# Altium schematic sheet 1.Input.SchDoc: 6.6kW Daul OBC +11kW WPT
size A3; Date: 23/03/6; Revision: V 1.0; SheetNumber: 1; SheetTotal: 14; PageSetup: Record=PageOptions|CenterHorizontal=True|CenterVertical=True|PrintScale=0.71|XCorrection=1.00|YCorrection=1.00|PrintKind=2|BorderSize=5000000|LeftOffset=0|BottomOffset=0|Orientation=2|PaperLength=1000|PaperWidth=1000|Scale=100|PaperSource=7|PrintQuality=-3|MediaType=1|DitherType=10|PrintScaleMode=1|PaperKind=A4|PaperIndex=9; ImagePath: 0
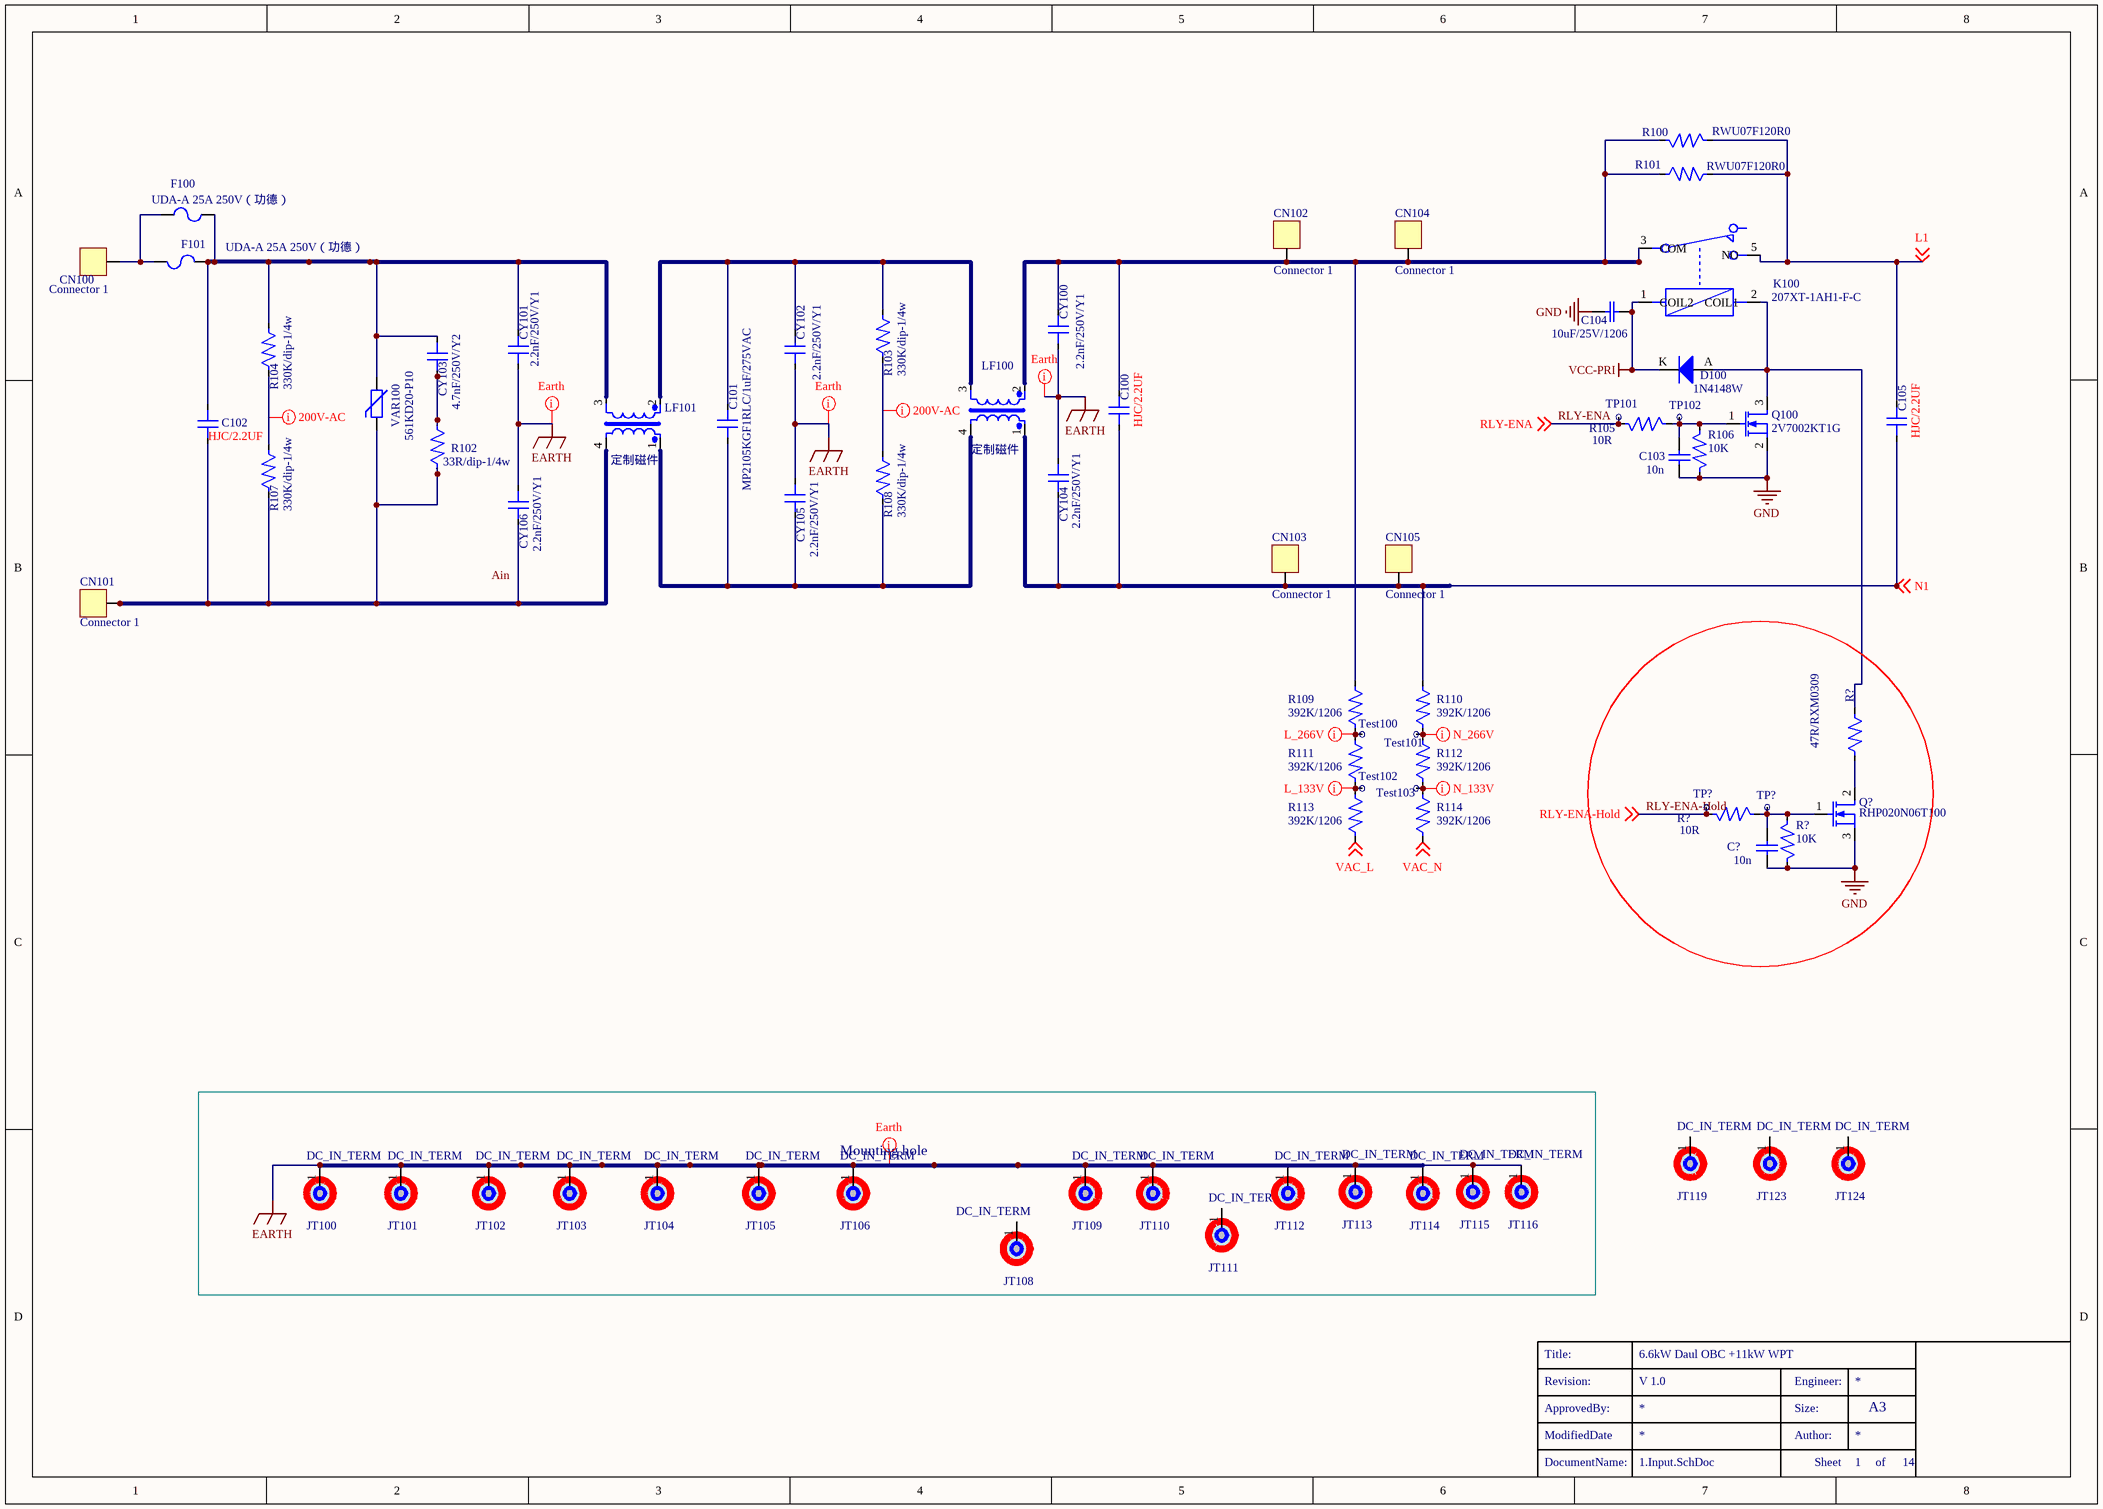
[diagram p0: 1.Input.SchDoc]

## Parts
(Parts that share a designator on the sheet are numbered #1, #2 ... from top to bottom, then left to right.)
C100  HJC/2.2UF  [CBOX_31x10_8_P_27_5]
C101  MP2105KGF1RLC/1uF/275VAC  [CBOX_31x10_8_P_27_5]
C102  HJC/2.2UF  [CBOX_31x13_P_27_5]
C103  10n  [C0402]
C104  10uF/25V/1206  [C1206]
C105  HJC/2.2UF  [CBOX_31x10_8_P_27_5]
C?  10n  [C0402]
CN100  Connector 1  [端子10x8x16]
CN101  Connector 1  [端子10x8x16]
CN102  Connector 1  [Wire_2.5_Hook]
CN103  Connector 1  [Wire_2.5_Hook]
CN104  Connector 1  [CON_4]
CN105  Connector 1  [CON_4]
CY100  2.2nF/250V/Y1  [C_DISK_7.5- D14]
CY101  2.2nF/250V/Y1  [C_DISK_7.5- D14]
CY102  2.2nF/250V/Y1  [C_DISK_7.5- D14]
CY103  4.7nF/250V/Y2  [C_DISK_8_0S]
CY104  2.2nF/250V/Y1  [C_DISK_7.5- D14]
CY105  2.2nF/250V/Y1  [C_DISK_7.5- D14]
CY106  2.2nF/250V/Y1  [C_DISK_7.5- D14]
D100  1N4148W  [D_SOD123]
F100  UDA-A 25A 250V（功德）  [Fuse-5.0-N_Vertical]
F101  UDA-A 25A 250V（功德）  [Fuse-5.0-N_Vertical]
JT100  DC_IN_TERM  [Mounting3_0]
JT101  DC_IN_TERM  [Mounting3_0]
JT102  DC_IN_TERM  [Mounting3_0]
JT103  DC_IN_TERM  [Mounting3_0]
JT104  DC_IN_TERM  [Mounting3_0]
JT105  DC_IN_TERM  [Mounting3_0]
JT106  DC_IN_TERM  [Mounting3_0]
JT108  DC_IN_TERM  [Mounting3_0]
JT109  DC_IN_TERM  [Mounting3_0]
JT110  DC_IN_TERM  [Mounting3_0]
JT111  DC_IN_TERM  [Mounting3_0]
JT112  DC_IN_TERM  [Mounting3_0]
JT113  DC_IN_TERM  [Mounting3_0]
JT114  DC_IN_TERM  [Mounting3_0]
JT115  DC_IN_TERM  [Mounting3_0]
JT116  DC_IN_TERM  [Mounting3_0]
JT119  DC_IN_TERM  [Mounting3_0]
JT123  DC_IN_TERM  [Mounting3_0]
JT124  DC_IN_TERM  [Mounting3_0]
K100  207XT-1AH1-F-C  [RELAY_110E]
LF100  定制磁件  [L_31*19*15_C]
LF101  定制磁件  [L_31*19*15_C]
Q100  2V7002KT1G  [Q_SOT23 - 2]
Q?  RHP020N06T100  [SOT89_MI]
R100  RWU07F120R0  [R7W-N]
R101  RWU07F120R0  [R7W-N]
R102  33R/dip-1/4w  [R1/4W]
R103  330K/dip-1/4w  [R1/4W]
R104  330K/dip-1/4w  [R1/4W]
R105  10R  [R0402]
R106  10K  [R0402]
R107  330K/dip-1/4w  [R1/4W]
R108  330K/dip-1/4w  [R1/4W]
R109  392K/1206  [R1206]
R110  392K/1206  [R1206]
R111  392K/1206  [R1206]
R112  392K/1206  [R1206]
R113  392K/1206  [R1206]
R114  392K/1206  [R1206]
R?#1  47R/RXM0309  [RXM0309]
R?#2  10R  [R0402]
R?#3  10K  [R0402]
Test100  测试点  [测试点]  (value not drawn)
Test101  测试点  [测试点]  (value not drawn)
Test102  测试点  [测试点]  (value not drawn)
Test103  测试点  [测试点]  (value not drawn)
TP101  测试点  [测试点]  (value not drawn)
TP102  测试点  [测试点]  (value not drawn)
TP?#1  测试点  [测试点]  (value not drawn)
TP?#2  测试点  [测试点]  (value not drawn)
VAR100  561KD20-P10  [471KD20 _10]

## Blocks framed on the sheet
Mounting hole: JT100-JT106 JT108-JT116

## Nets
EARTH: CY100.2 CY101.2 CY102.2 CY104.1 CY105.1 CY106.1 JT100.1 JT101.1 JT102.1 JT103.1 JT104.1 JT105.1 JT106.1 JT109.1 JT110.1 JT113.1 JT115.1 JT116.1
GND: C103.2 C104.2 C?.2 Q100.2(S) Q?.3(S) R106.2 R?#3.2
VCC-PRI: C104.1 D100.K K100.1(COIL2)
L1: C105.1 K100.5(NO) R100.2 R101.2 ; off-sheet L1
N1: C100.2 C105.2 CN103.1 CN105.1 CY104.2 LF100.1 R110.2 ; off-sheet N1
RLY-ENA: R105.2 TP101.1 ; off-sheet RLY-ENA
RLY-ENA-Hold: R?#2.2 TP?#1.1 ; off-sheet RLY-ENA-Hold
VAC_L: R113.1 ; off-sheet VAC_L
VAC_N: R114.1 ; off-sheet VAC_N
NetC100_1: C100.1 CN102.1 CN104.1 CY100.1 K100.3(COM) LF100.2 R100.1 R101.1 R109.2
NetC101_1: C101.1 CY105.2 LF100.4 LF101.1 R108.1
NetC101_2: C101.2 CY102.1 LF100.3 LF101.2 R103.2
NetC102_1: C102.1 CY101.1 CY103.1 F100.2 F101.1 LF101.3 R104.2 VAR100.1
NetC102_2: C102.2 CN101.1 CY106.2 LF101.4 R102.1 R107.1 VAR100.2
NetC103_1: C103.1 Q100.1(G) R105.1 R106.1 TP102.1
NetC?_1: C?.1 Q?.1(G) R?#2.1 R?#3.1 TP?#2.1
NetCN100_1: CN100.1 F100.1 F101.2
NetCY103_2: CY103.2 R102.2
NetD100_A: D100.A K100.2(COIL1) Q100.3(D) R?#1.1
NetQ?_2: Q?.2(D) R?#1.2
NetR103_1: R103.1 R108.2
NetR104_1: R104.1 R107.2
NetR109_1: R109.1 R111.2 Test100.1
NetR110_1: R110.1 R112.2 Test101.1
NetR111_1: R111.1 R113.2 Test102.1
NetR112_1: R112.1 R114.2 Test103.1

Not connected (* = marked no-connect by the designer): JT108 1(0); JT111 1(0); JT112 1(0); JT114 1(0); JT119 1(0); JT123 1(0); JT124 1(0)

## Layout directives
net class Earth: EARTH
net class 200V-AC: NetR103_1, NetR104_1
net class Primary; net class N_266V; net class AC2: NetR110_1
net class Primary; net class N_133V; net class AC2: NetR112_1
net class Primary; net class L_266V; net class AC2: NetR109_1
net class Primary; net class L_133V; net class AC2: NetR111_1

## Notes on the sheet
- Labels drawn without touching a wire or pin: Ain
- Revision:
- Title:
- Engineer:
- ModifiedDate
- ApprovedBy:
- Author:
- Size:
- A3
- DocumentName:
- Sheet
- of

## Library data of the parts
C100-C102 C105 = CAPACITOR_ XCAP: SAFETY Capacitor; Revision: 1
  C100 C102 C105: Parameter: HJC/2.2UF; VALUE: HJC/2.2UF
  C101: Parameter: MP2105KGF1RLC/1uF/275VAC; VALUE: MP2105KGF1RLC/1uF/275VAC
C103 C? = CAP: value: 10n; Parameter: 10n
C104 = CAP0603: Manufacturer: {Manufacturer}; Manufacturer P/N: {Manufacturer P/N}; DIP/SMD: SMD; Top/Bottom: Top; VALUE: 10uF/25V/1206; Package: {Package}; Part Number: *; Parameter: 10uF/25V/1206
CN100-CN105 = Connector 1: Header, 1-Pin; Revision: 17-Jul-2002: Re-released for DXP Platform.; Publisher: Altium Limited; Parameter: Connector 1
CY100 CY101 CY104 CY106 = CAPACITOR_ YCAP: SAFETY Capacitor; Revision: 1; VALUE: 2.2nF/250V/Y1; Parameter: 2.2nF/250V/Y1
CY102 CY105 = CAPACITOR_ YCAP: SAFETY Capacitor; VALUE: 2.2nF/250V/Y2/φ8; Revision: 1; Parameter: 2.2nF/250V/Y1
CY103 = CAPACITOR_ YCAP: Manufacturer: muRata; Manufacturer P/N: DE6E3KJ472MA3B; DIP/SMD: DIP; Parameter: 4.7nF/250V/Y2
D100 = DIODE_BAT54J: 75V 250mA SOD-523 MCC; DIP/SMD: SMD; Top/Bottom: Bottom; VALUE: 1N4148W; Part Number: *; Parameter: 1N4148W
F100 F101 = FUSE_BOX: BOX TYPE FUSE; Revision: July-2002: Re-released for DXP Platform.; VALUE: UDA-A 25A 250V（功德）; Parameter: UDA-A 25A 250V（功德）
JT100-JT106 JT108-JT116 JT119 JT123 JT124 = Terminal: Manufacturer P/N: DC_IN_TERM; Parameter: DC_IN_TERM
K100 = RELAYSPDT/16A: 12V 一组常开触点 4Pin hongfra; DIP/SMD: DIP; Top/Bottom: Top; VALUE: 207XT-1AH1-F-C; Part Number: *; Parameter: 207XT-1AH1-F-C
LF100 LF101 = LINE FILTER_RING CORE: DIP/SMD: DIP
Q100 = MOSFET_N CHANNEL: Manufacturer: ONSemi; DIP/SMD: SMD; Manufacturer P/N: 2V7002KT1G
Q? = MOSFET_N CHANNEL: N MOS FET; DIP/SMD: SMD; Top/Bottom: Bottom; VALUE: RHP020N06T100; BQ-CCCP: BQ-CCCP; Parameter: RHP020N06T100
R100 R101 = RESISTOR_1206: RESISTOR; DIP/SMD: DIP; Top/Bottom: Top; VALUE: RWU07F120R0; Part Number: *; Parameter: RWU07F120R0
R102 = RESISTOR_1206: RESISTOR; Parameter: 33R/dip-1/4w; VALUE: 33R/dip-1/4w
R103 R104 R107 R108 = RESISTOR_1206: DIP/SMD: DIP; Parameter: 330K/dip-1/4w
R105 R?#2 = RESISTOR_1206: 10R 1% 厚膜 1/16W 0402 YAGEO; DIP/SMD: SMD; Top/Bottom: Bottom; VALUE: 10R; Part Number: *; Parameter: 10R
R106 R?#3 = RESISTOR_1206: 10K 1% 厚膜 1/16W 0402 YAGEO; DIP/SMD: SMD; Top/Bottom: Bottom; VALUE: 10K; Part Number: *; Parameter: 10K
R109-R114 = RESISTOR_1206: Manufacturer: Yageo; Manufacturer P/N: AC1206FR-07392KL; DIP/SMD: SMD; Parameter: 392K/1206
R?#1 = RESISTOR_1210: RESISTOR; DIP/SMD: SMD; Top/Bottom: Top
VAR100 = VARISTOR: Parameter: 561KD20-P10; VALUE: 561KD20-P10
Test100-Test103 TP101 TP102 TP?#1 TP?#2 = 测试点: Parameter: 测试点